# Altium schematic sheet accelerometer.SchDoc
size 292 x 193 mm; Author: Antoni Pękała; CompanyName: Politechnika Warszawska; Organization: EITI; Address1: Nowowiejska 15/19; Address2: 00-665 Warszawa; SheetNumber: 4; SheetTotal: 4; ProjName: Smartwatch; Group_Name: Smartwatch; HTTPLink: www.pw.edu.pl
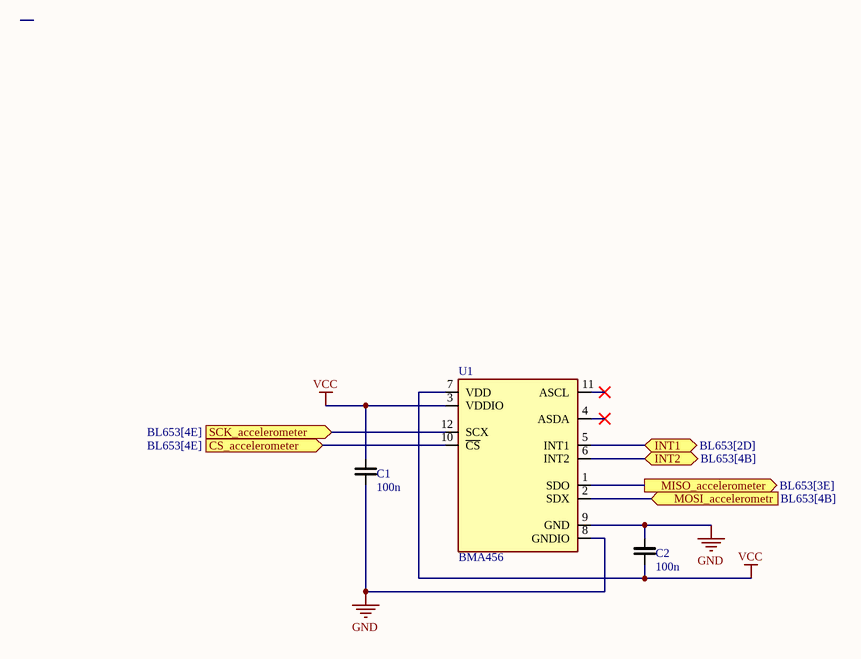
[diagram p0: accelerometer.SchDoc]

## Parts
C1  100n  [0402_CAP_REFLOW]
C2  100n  [0402_CAP_REFLOW]
U1  BMA456  [FP-BMA456-MFG]

## Ports
CS_accelerometer (in, see BL653[4E]), INT1 (bidir, see BL653[2D]), INT2 (bidir, see BL653[4B]), MISO_accelerometer (out, see BL653[3E]), MOSI_accelerometr (in, see BL653[4B]), SCK_accelerometer (in, see BL653[4E])

## Nets
GND: C1.1 C2.2 U1.8(GNDIO) U1.9(GND)
VCC: C1.2 C2.1 U1.3(VDDIO) U1.7(VDD)
CS_accelerometer: U1.10(~{CS}) ; port CS_accelerometer
INT1: U1.5(INT1) ; port INT1
INT2: U1.6(INT2) ; port INT2
MISO_accelerometer: U1.1(SDO) ; port MISO_accelerometer
MOSI_accelerometr: U1.2(SDX) ; port MOSI_accelerometr
SCK_accelerometer: U1.12(SCX) ; port SCK_accelerometer

Not connected (* = marked no-connect by the designer): U1 4(ASDA)* 11(ASCL)*

## Notes on the sheet
- Data:
- Tytuł:
- Rev.:
- Rozm.:
- A4
- Strona:
- z
- PBL4
- Opracował:

## Library data of the parts
C1 C2 = CAP_100n: Ceramic capacitor
U1 = CMP-191065-000002-1: ACCEL 2-16G I2C/SPI 12LGA; Manufacturer: Bosch Sensortec; Accel Range: 2/4/8/16g; Max Supply Voltage: 3.6V; Accel Axis: X+Y and Z; Frequency: 1.6kHz; Operating Supply Current: 150uA; Min Supply Voltage: 1.2V; Sensor Output: I2C,SPI; Accel Sensitivity: 2048-16384LSB/g; Mouser Description: BMA456 Series 3.6 V 1.6 kHz Digital Triaxial Acceleration Sensor - LGA-12; Category: IC; Ambient Temperature Range High: +85°C; Package: 0; RoHS: TRUE; Device Class L2: Motion Sensors; ComponentLink2URL: https://ae-bst.resource.bosch.com/media/_tech/media/datasheets/BST-BMA456-DS000.pdf; Temperature: -40°C to +85°C; Digikey Description: ACCEL 2-16G I2C/SPI 12LGA; Device Class L1: Sensors; Height: 0.7mm; Temperature Range Low: -40°C; Automotive: No; Manufacturer Part Number: BMA456; Lead Free: Yes; ComponentLink2Description: Datasheet; Octopart: https://octopart.com/bma456-bosch+sensortec-99488369; Temperature Range High: +85°C; Device Class L3: Accelerometers; Ambient Temperature Range Low: -40°C